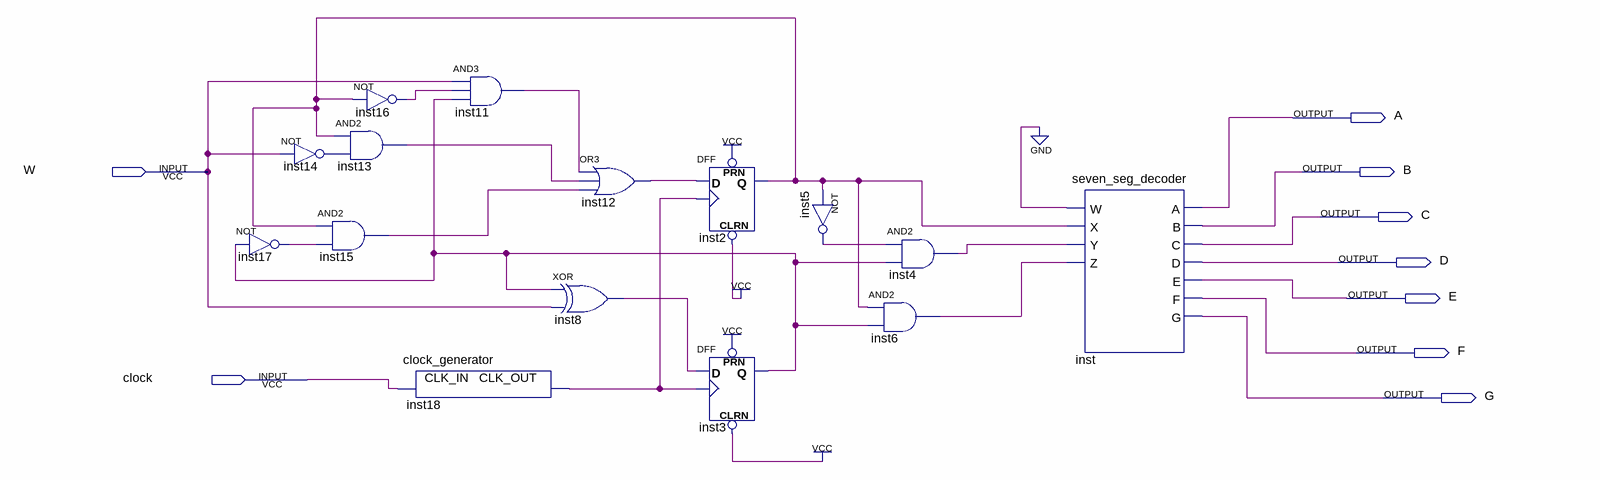
[diagram p0: schematic sheet]
// Quartus schematic SimCounter.bdf as structural Verilog: 15 symbols, 9 pins
module SimCounter (
  input  W,
  input  clock,
  output A,
  output B,
  output C,
  output D,
  output E,
  output F,
  output G
);

  wire inst2_q, inst3_q, inst4_out, inst5_out, inst6_out, inst8_out, inst11_out, inst12_out, inst13_out,
       inst14_out, inst15_out, inst16_out, inst17_out, inst18_clk_out;

  not inst17 (inst17_out, inst3_q);
  and inst13 (inst13_out, inst2_q, inst14_out);
  not inst14 (inst14_out, W);
  and inst15 (inst15_out, inst2_q, inst17_out);
  not inst16 (inst16_out, inst2_q);
  clock_generator inst18 (.CLK_IN(clock), .CLK_OUT(inst18_clk_out));
  and inst11 (inst11_out, W, inst16_out, inst3_q);
  xor inst8 (inst8_out, inst3_q, W);
  or inst12 (inst12_out, inst11_out, inst13_out, inst15_out);
  DFF inst2 (.CLRN(1'b1), .CLK(inst18_clk_out), .D(inst12_out), .PRN(1'b1), .Q(inst2_q));
  DFF inst3 (.CLRN(1'b1), .CLK(inst18_clk_out), .D(inst8_out), .PRN(1'b1), .Q(inst3_q));
  not inst5 (inst5_out, inst2_q);
  and inst4 (inst4_out, inst5_out, inst3_q);
  and inst6 (inst6_out, inst2_q, inst3_q);
  seven_seg_decoder inst (
    .W(1'b0), .X(inst2_q), .Y(inst4_out), .Z(inst6_out), .A(A), .B(B), .C(C), .D(D), .E(E), .F(F), .G(G));
endmodule
